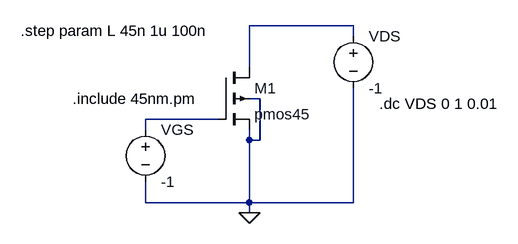
[diagram p0: schematic PMOS-L-W.asc]
PMOS-L-W.asc, the LTspice schematic file:
Version 4.1
SHEET 1 880 680
WIRE 352 32 192 32
WIRE 352 48 352 32
WIRE 192 96 192 32
WIRE 208 144 192 144
WIRE 144 176 32 176
WIRE 32 192 32 176
WIRE 192 208 192 192
WIRE 208 208 208 144
WIRE 208 208 192 208
WIRE 32 304 32 272
WIRE 192 304 192 208
WIRE 192 304 32 304
WIRE 352 304 352 128
WIRE 352 304 192 304
WIRE 192 320 192 304
FLAG 192 320 0
SYMBOL pmos4 144 96 R0
SYMATTR InstName M1
SYMATTR Value pmos45
SYMATTR Value2 l=L w=1u
SYMBOL voltage 32 176 R0
WINDOW 123 0 0 Left 0
WINDOW 39 0 0 Left 0
SYMATTR InstName VGS
SYMATTR Value -1
SYMBOL voltage 352 32 R0
WINDOW 123 0 0 Left 0
WINDOW 39 0 0 Left 0
SYMATTR InstName VDS
SYMATTR Value -1
TEXT -80 144 Left 2 !.include 45nm.pm
TEXT -160 40 Left 2 !.step param L 45n 1u 100n
TEXT 392 152 Left 2 !.dc VDS 0 1 0.01

The netlist it stands for:
* PMOS-L-W.asc
M1 N001 N002 0 0 pmos45 l=L w=1u
VGS N002 0 -1
VDS N001 0 -1
.model NMOS NMOS
.model PMOS PMOS
.lib standard.mos
.include 45nm.pm
.step param L 45n 1u 100n
.dc VDS 0 1 0.01
.backanno
.end